# EAGLE design button_brick_smd (EAGLE 7.2.0)
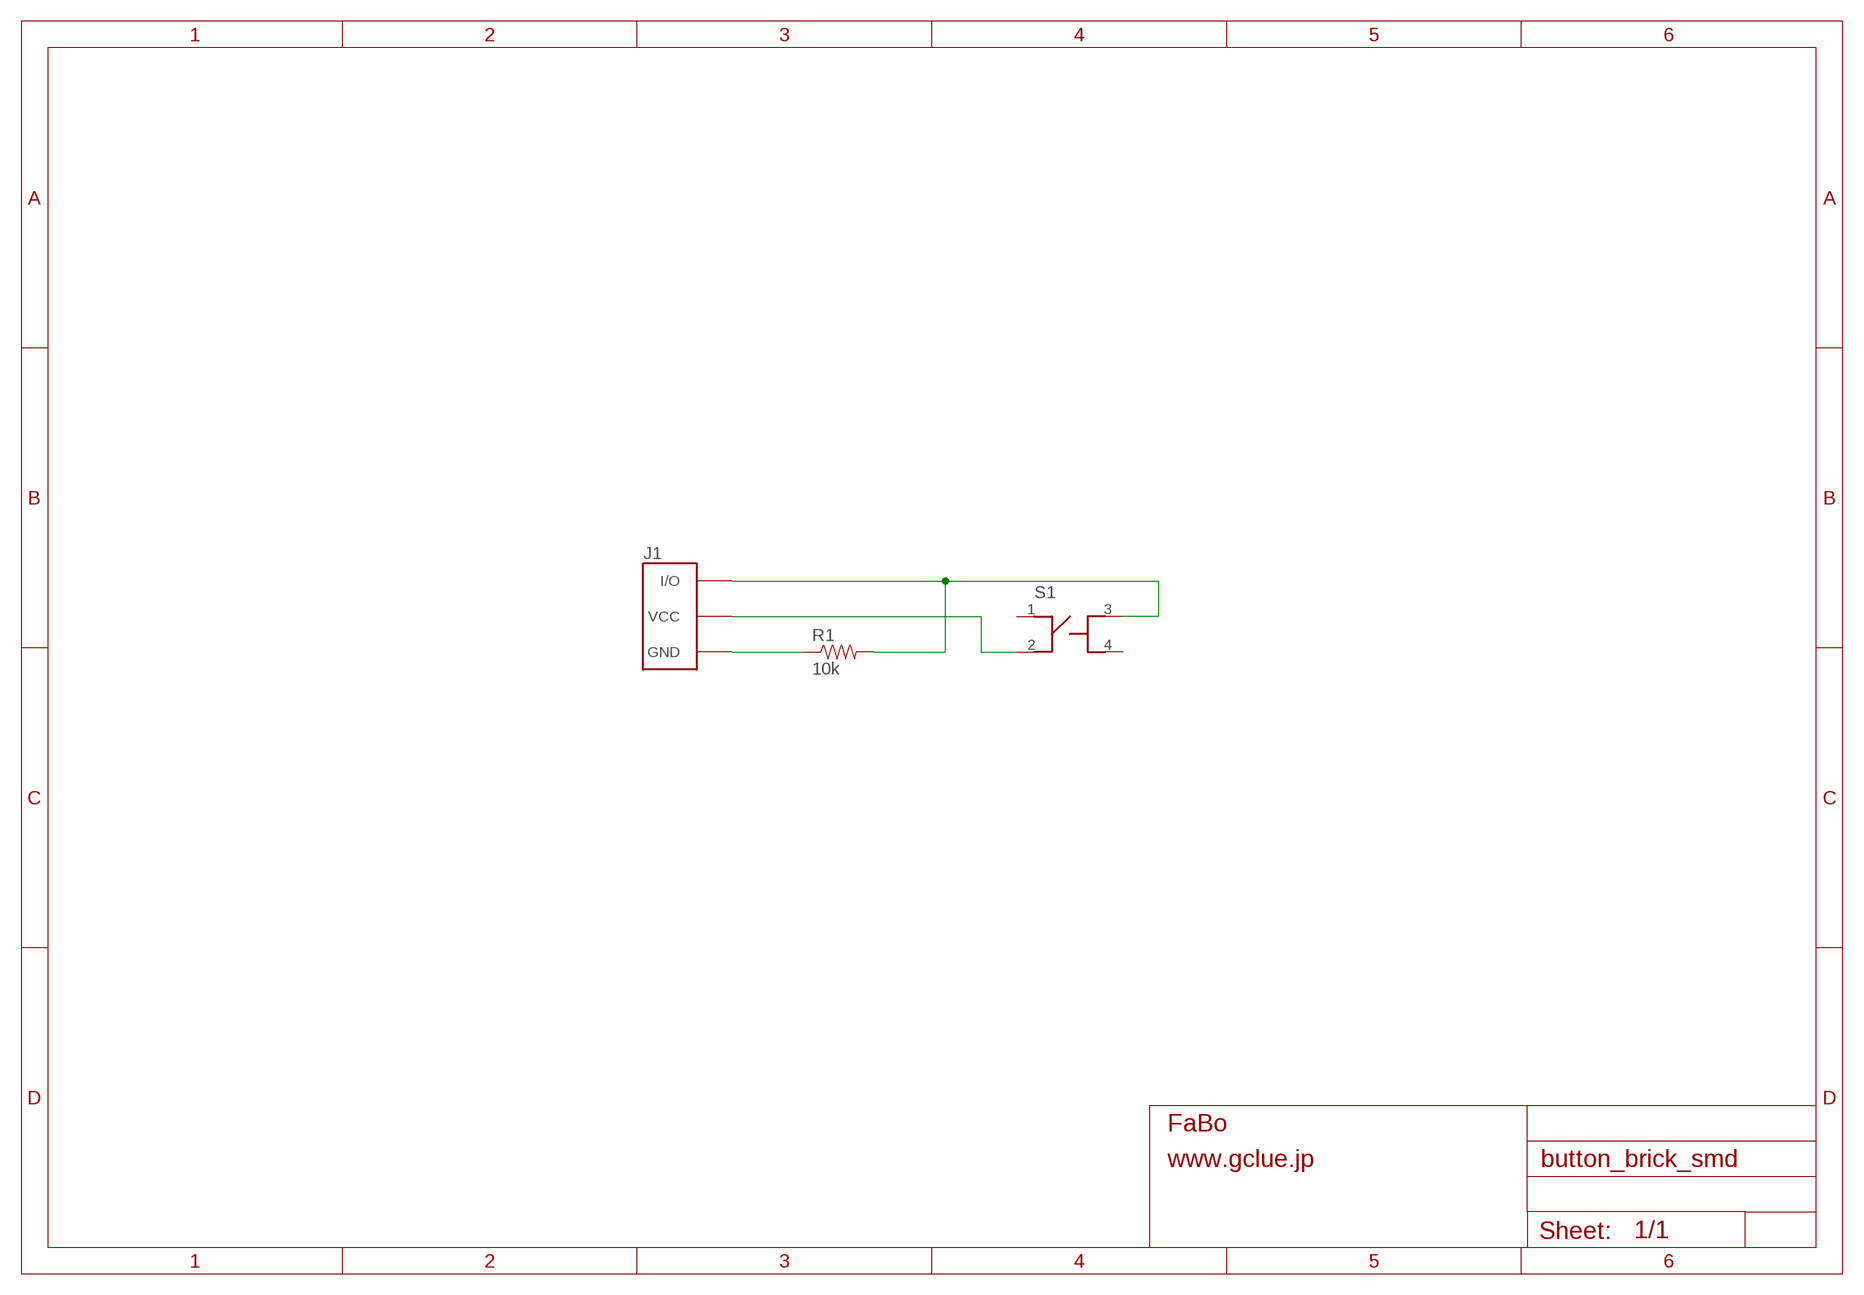
[diagram p0: schematic, sheet 1]

## Parts
J1  BRICK_3PIN  [BRICK_3PIN]
R1  10k  RESISTOR0603  [0603-RES]
S1  SWITCH-LS6J2M-T  [SWITCH-LS6J2M-T]

## Nets
GND: J1.GND R1.1
N$1: J1.VCC S1.2
N$3: J1.IN/OUT(I/O) R1.2 S1.3
Unconnected: S1.1 S1.4

## Library data of the parts
J1 = gclue:BRICK_3PIN: FaBo Brick 3pin
R1 = SparkFun-Resistors:RESISTOR: Resistor Basic schematic elements and footprints for 0603, 1206, and PTH resistors.
S1 = gclue:SWITCH-LS6J2M-T: Switch Tact SMD(LS6J2M-T)

## Board
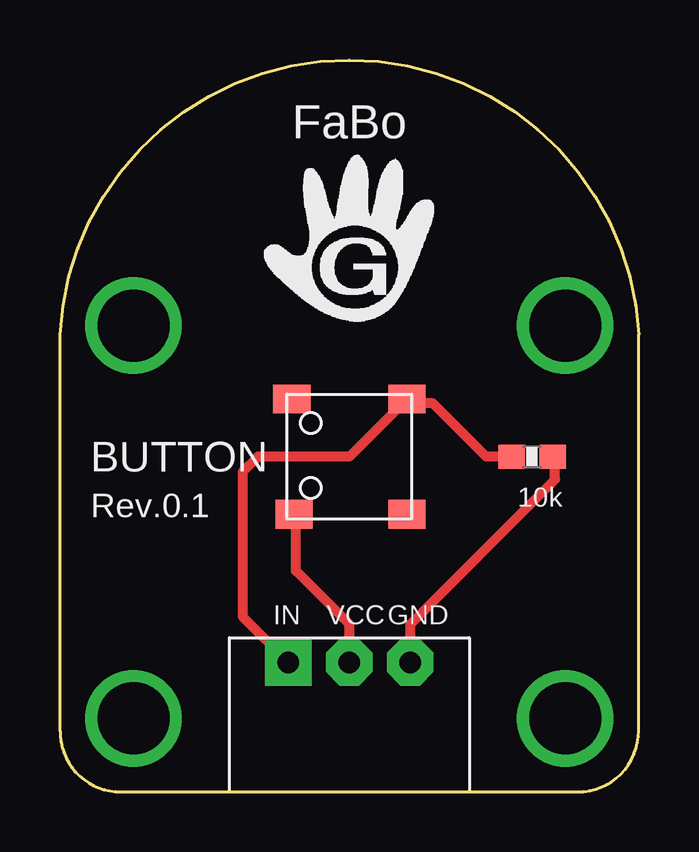
[diagram p1: board, top side]
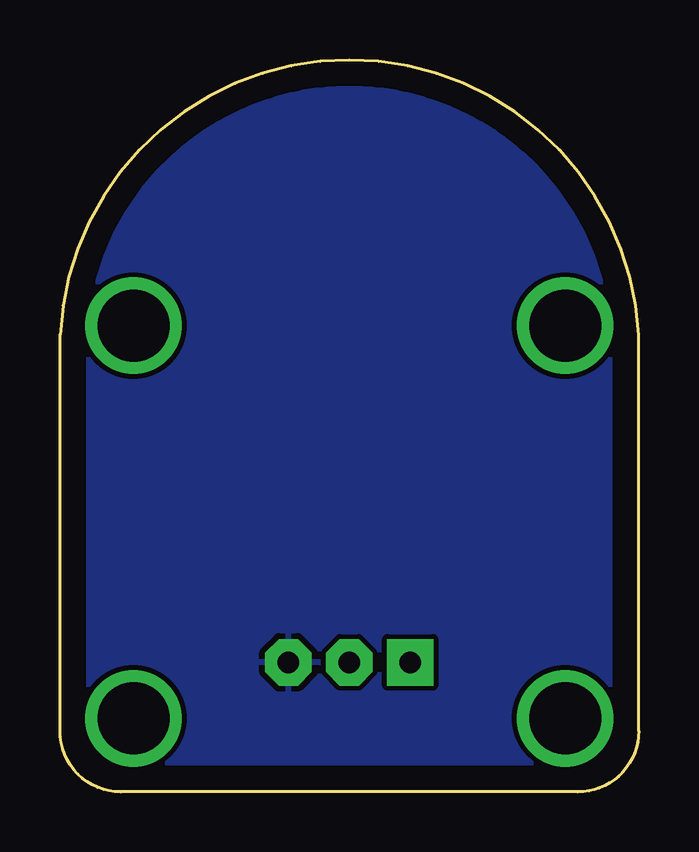
[diagram p2: board, bottom side, seen from below]

Size 24.13 x 30.5 mm. Coordinates in mm from the lower left corner, seen from the top.
Copper layers (1*16): Top 0.035mm / dielectric 1.5mm / Bottom 0.035mm
Design rules "default": minimum track width 10mil, minimum drill 24mil, track to track 8mil, track to pad 8mil, pad to pad 8mil, via to via 8mil, smd to smd 8mil, copper to edge 40mil, drill to drill 8mil, minimum pad ring 10mil, minimum via ring 8mil, stop-mask expansion 4mil, vias tented up to drill 0mil, thermal gap 10mil

### Footprints (pad centres in the part's own frame; a part is rotated, then mirrored left to right if it is on the bottom)
BRICK_3PIN = drill 0.9 pad 1.93 octagon: GND 2.54,-8.572; VCC 0,-8.572 | drill 0.9 pad 1.93 square: IN/OUT -2.54,-8.572 | drill 3 pad 3.81: P$1 -9,5.46; P$2 9,5.46; P$3 9,-10.905; P$4 -9,-10.905
0603-RES = smd 1.1 x 1: 1 -0.85,0; 2 0.85,0
SWITCH-LS6J2M-T = smd 1.55 x 1.2: 1 -2.4,2.4; 2 -2.3,-2.4; 3 2.4,2.4; 4 2.4,-2.4

### Placement (x,y rotation side)
J1  12.06,13.97 0 top
R1  19.69,13.97 180 top
S1  12.06,13.97 0 top

### Tracks (layer width: path | path; a pad name or v marks a point on that pad's centre or on a via)
GND
  Top 0.406: J1.GND 14.61,6.99 20.64,13.02 20.64,13.87 R1.1
  pour Bottom: -0.63,-0.63 24.77,-0.63 24.77,31.12 -0.63,31.12
N$1
  Top 0.406: J1.VCC 12.06,6.99 9.84,9.21 9.84,11.49 S1.2
N$3
  Top 0.406: R1.2 17.78,13.97 15.56,16.19 14.64,16.19 S1.3 12.06,13.97 8.26,13.97 7.62,13.34 7.62,7.3 J1.IN/OUT

### Text on the board
tPlace: BUTTON | Rev.0.1 | IN | VCC | GND